# EAGLE design cytron-1 (EAGLE 9.6.2)
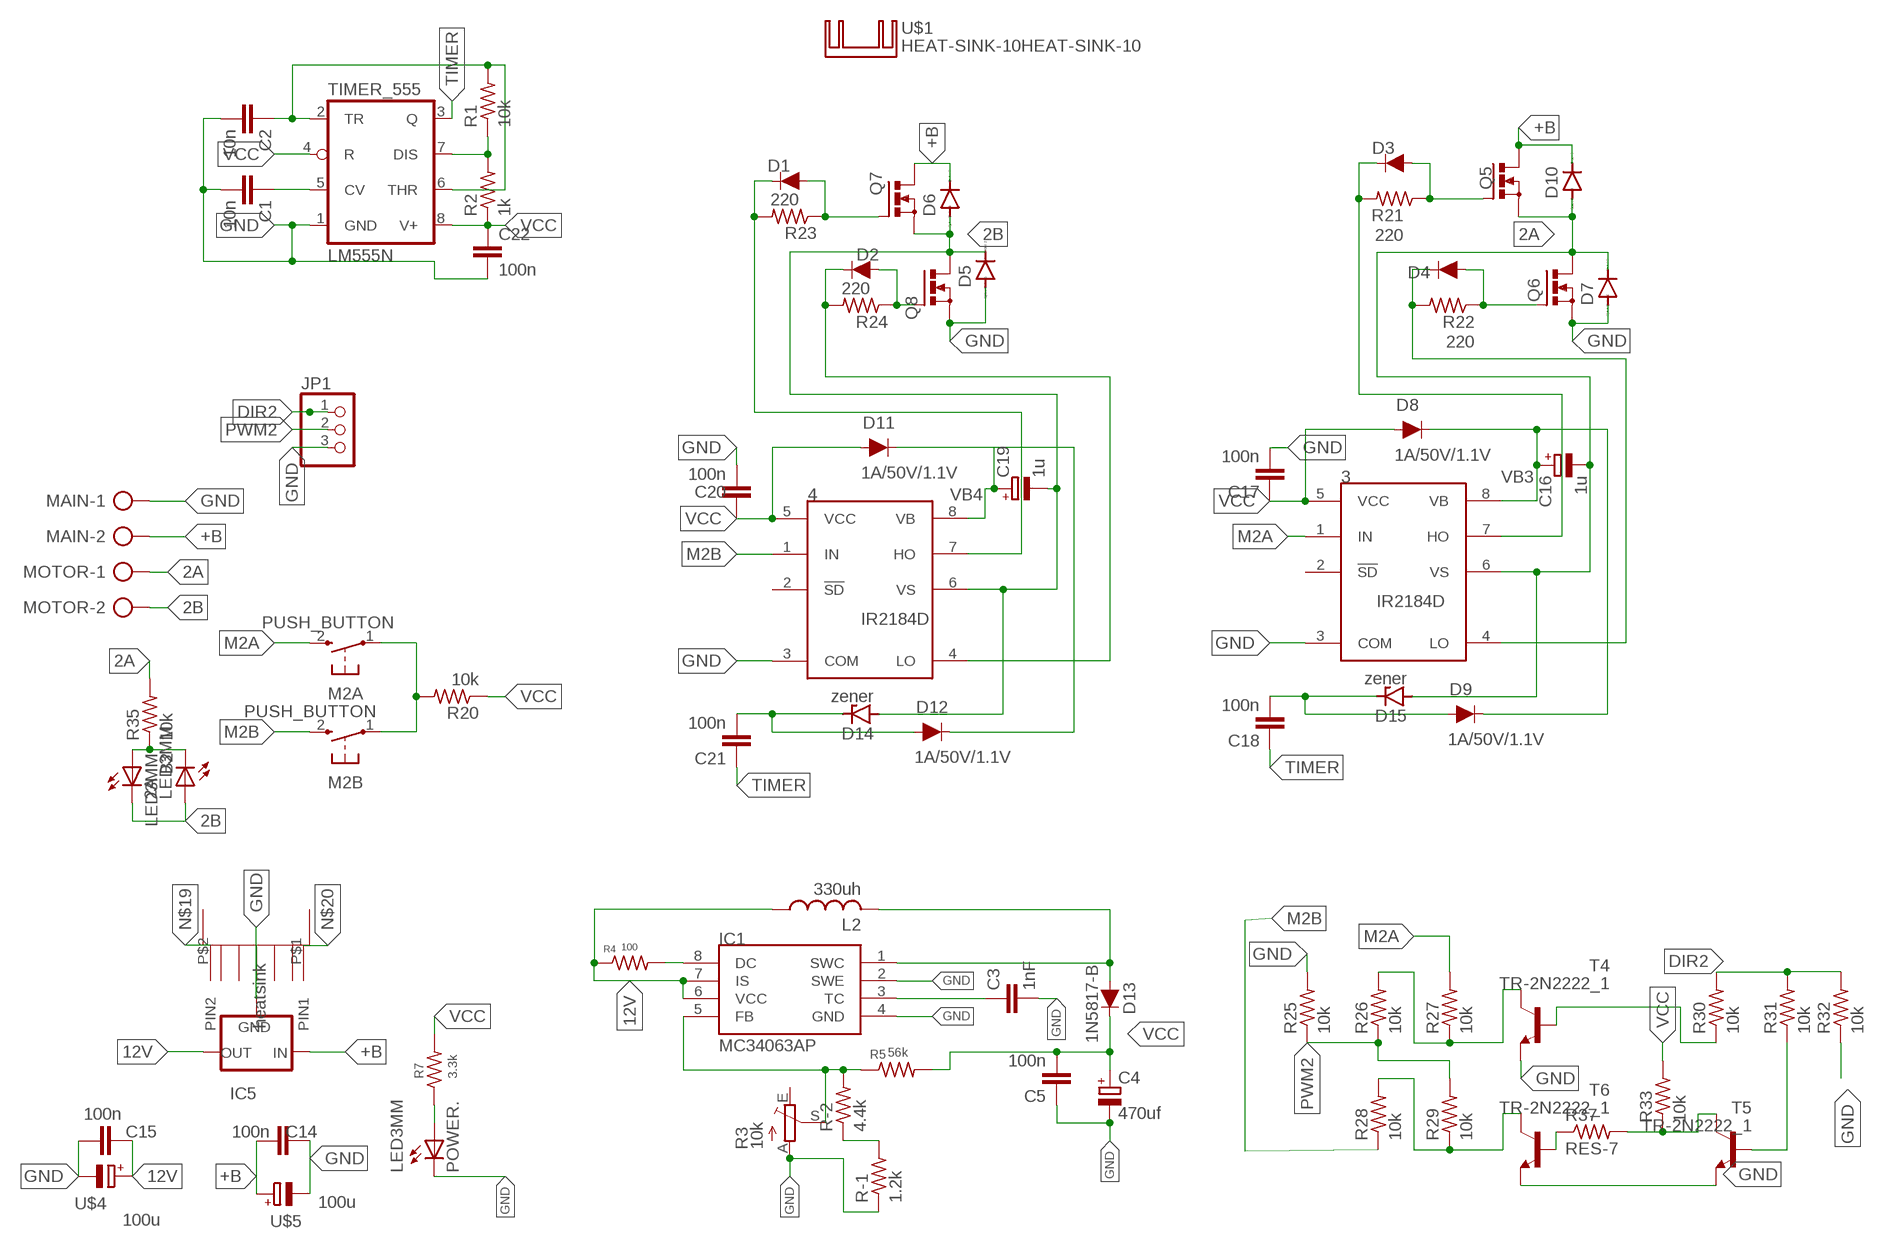
[diagram p0: schematic, sheet 1]

## Parts
2A  LED3MM  [LED3MM]
3  IR2184D  [DIL08]
4  IR2184D  [DIL08]
B2  LED3MM  [LED3MM]
C1  10n  CAPACITOR  [C025-025X050]
C2  10n  CAPACITOR  [C025-025X050]
C3  1nF  CAPACITOR  [C025-025X050]
C4  470uf  CAP_POL  [E3,5-8]
C5  100n  CAPACITOR  [C025-025X050]
C14  100n  CAPACITOR  [C025-025X050]
C15  100n  CAPACITOR  [C025-025X050]
C16  1u  CPOL-EUE5-5  [E5-5]
C17  100n  CAPACITOR  [C025-025X050]
C18  100n  CAPACITOR  [C025-025X050]
C19  1u  CPOL-EUE5-5  [E5-5]
C20  100n  CAPACITOR  [C025-025X050]
C21  100n  CAPACITOR  [C025-025X050]
C22  100n  CAPACITOR  [C025-025X050]
D1  1A/50V/1.1V  DIODE(1A)-PTH  [DIODE-1N4001]
D2  1A/50V/1.1V  DIODE(1A)-PTH  [DIODE-1N4001]
D3  1A/50V/1.1V  DIODE(1A)-PTH  [DIODE-1N4001]
D4  1A/50V/1.1V  DIODE(1A)-PTH  [DIODE-1N4001]
D5  BY396  [DO201-15]
D6  BY396  [DO201-15]
D7  BY396  [DO201-15]
D8  1A/50V/1.1V  DIODE(1A)-PTH  [DIODE-1N4001]
D9  1A/50V/1.1V  DIODE(1A)-PTH  [DIODE-1N4001]
D10  BY396  [DO201-15]
D11  1A/50V/1.1V  DIODE(1A)-PTH  [DIODE-1N4001]
D12  1A/50V/1.1V  DIODE(1A)-PTH  [DIODE-1N4001]
D13  1N5817-B  DIODE(1A)-PTH  [DIODE-1N4001]
D14  zener  BZD23  [SOD81]
D15  zener  BZD23  [SOD81]
IC1  MC34063AP  [DIL08]
IC5  78XXS  [78XXS]
JP1  PINHD-3_DATA  [1X03_DATA]
L2  330uh  INDUCTOR-2PIS2816  [PIS2816]
M2A  PUSH_BUTTON  [B3F-10XX]
M2B  PUSH_BUTTON  [B3F-10XX]
MAIN  ROSTA.POWER  [W239-302]
MOTOR  ROSTA.POWER  [W239-302]
POWER.  LED3MM  [LED3MM]
Q5  MOSFET_NTO220BV  [TO220BV]
Q6  MOSFET_NTO220BV  [TO220BV]
Q7  MOSFET_NTO220BV  [TO220BV]
Q8  MOSFET_NTO220BV  [TO220BV]
R1  10k  R-US_0204/7  [0204/7]
R2  1k  R-US_0204/7  [0204/7]
R3  10k  TRIM_EU-CA6V  [CA6V]
R4  100  RES-7  [0204/7]
R5  56k  RES-7  [0204/7]
R7  3.3k  RES-7  [0204/7]
R20  10k  R-US_0204/7  [0204/7]
R21  220  R-US_0204/7  [0204/7]
R22  220  R-US_0204/7  [0204/7]
R23  220  R-US_0204/7  [0204/7]
R24  220  R-US_0204/7  [0204/7]
R25  10k  R-US_0204/7  [0204/7]
R26  10k  R-US_0204/7  [0204/7]
R27  10k  R-US_0204/7  [0204/7]
R28  10k  R-US_0204/7  [0204/7]
R29  10k  R-US_0204/7  [0204/7]
R30  10k  R-US_0204/7  [0204/7]
R31  10k  R-US_0204/7  [0204/7]
R32  10k  R-US_0204/7  [0204/7]
R33  10k  R-US_0204/7  [0204/7]
R35  10k  R-US_0204/7  [0204/7]
R37  RES-7  [0204/7]
R-1  1.2k  RES-7  [0204/7]
R-2  4.4k  RES-7  [0204/7]
T4  TR-2N2222_1  [TO92-EBC]
T5  TR-2N2222_1  [TO92-EBC]
T6  TR-2N2222_1  [TO92-EBC]
TIMER_555  LM555N  [DIL08]
U$1  HEAT-SINK-10HEAT-SINK-10  [HS10]
U$3  HEAT-SINK  [HEAT_SINK]
U$4  100u  CAP_POL  [E3,5-8]
U$5  100u  CAP_POL  [E3,5-8]

## Nets
2A: 3.6(VS) C16.- D7.C D10.A D15.A MOTOR.1 Q5.S Q6.D R35.2
2B: 2A.K(C) 4.6(VS) B2.A C19.- D5.C D6.A D14.A MOTOR.2 Q7.S Q8.D
12V: C15.2 IC1.6(VCC) IC1.7(IS) IC5.OUT L2.1 R4.1 U$4.+
+B: C14.1 D6.C D10.C IC5.IN MAIN.2 Q5.D Q7.D U$5.+
DIR2: JP1.1 R30.2 R31.2 R32.2
GND: 3.3(COM) 4.3(COM) C1.2 C2.2 C3.2 C4.- C5.1 C14.2 C15.1 C17.2 C20.2 C22.2 D5.A D7.A IC1.2(SWE) IC1.4(GND) IC5.GND JP1.3 MAIN.1 POWER..K(C) Q6.S Q8.S R3.A R25.2 R32.1 R-1.1 T4.E T5.E T6.E TIMER_555.1(GND) U$4.- U$5.-
M2A: 3.1(IN) M2A.2(S) R27.2
M2B: 4.1(IN) M2B.2(S) R28.1
N$2: C1.1 TIMER_555.5(CV)
N$3: R1.1 R2.2 TIMER_555.7(DIS)
N$4: C2.1 R1.2 TIMER_555.2(TR) TIMER_555.6(THR)
N$5: D4.A Q6.G R22.1
N$6: 3.4(LO) D4.C R22.2
N$7: M2A.1(P) M2B.1(P) R20.2
N$8: R37.1 T6.B
N$9: C3.1 IC1.3(TC)
N$10: D13.A IC1.1(SWC) L2.2
N$11: 4.7(HO) D1.C R23.2
N$12: IC1.5(FB) R3.S R5.1 R-2.2
N$13: 4.4(LO) D2.C R24.2
N$15: IC1.8(DC) R4.2
N$16: POWER..A R7.1
N$19: U$3.P$2(PIN2)
N$20: U$3.P$1(PIN1)
N$21: R-1.2 R-2.1
N$25: D3.A Q5.G R21.1
N$30: 3.7(HO) D3.C R21.2
N$31: C18.2 D9.A D15.C
N$32: D2.A Q8.G R24.1
N$33: D1.A Q7.G R23.1
N$36: C21.2 D12.A D14.C
N$37: R28.2 R29.1 T6.C
N$38: R26.2 R27.1 T4.C
N$39: R30.1 T4.B
N$40: R33.1 R37.2 T5.C
N$41: R31.1 T5.B
N$46: 2A.A B2.K(C) R35.1
PWM2: JP1.2 R25.1 R26.1 R29.2
TIMER: C18.1 C21.1 TIMER_555.3(Q)
VB3: 3.8(VB) C16.+ D8.C D9.C
VB4: 4.8(VB) C19.+ D11.C D12.C
VCC: 3.5(VCC) 4.5(VCC) C4.+ C5.2 C17.1 C20.1 C22.1 D8.A D11.A D13.C R2.1 R5.2 R7.2 R20.1 R33.2 TIMER_555.4(R) TIMER_555.8(V+)
Unconnected: 3.2(!SD) 4.2(!SD) R3.E

## Library data of the parts
2A B2 = MIA_LIBRARY-2-2-2:LED3MM
3 4 = MIA_LIBRARY-2-2-2:IR2184
C1 C2 C5 C14 C15 C17 C18 C20-C22 = MIA_LIBRARY-2-2-2:CAPACITOR
C3 = MIA_LIBRARY-2-2-2:CAPACITOR; SPICEPREFIX: C
C4 = MIA_LIBRARY-2-2-2:CAP_POL; SPICEPREFIX: C
C16 C19 = rcl8:CPOL-EU: POLARIZED CAPACITOR, European symbol; SPICEPREFIX: C
D1-D4 D8 D9 D11 D12 = MIA_LIBRARY-2-2-2:DIODE(1A): Diode These are standard reverse protection diodes and small signal diodes. SparkFun Products: SparkFun SparkPunk Sound Kit <https://www.sparkfun.com/products/11177> SparkFun ESP8266 Thing <https://www.sparkfun.com/products/13231>; PROD_ID: DIO-09176
D5-D7 D10 = diode:BY396: DIODE Si,100 V, 3 A
D13 = MIA_LIBRARY-2-2-2:DIODE(1A): Diode These are standard reverse protection diodes and small signal diodes. SparkFun Products: SparkFun SparkPunk Sound Kit <https://www.sparkfun.com/products/11177> SparkFun ESP8266 Thing <https://www.sparkfun.com/products/13231>; PROD_ID: DIO-09176; SPICEPREFIX: D; VALUE: 1A/50V/1.1V
D14 D15 = diode:BZD23: Z DIODE
IC1 = MIA_LIBRARY-2-2-2:MC34063; SPICEPREFIX: X
IC5 = MIA_LIBRARY-2-2-2:78XXS: VOLTAGE REGULATOR
JP1 = MIA_LIBRARY-2-2-2:PINHD-3_DATA: PIN HEADER
L2 = MIA_LIBRARY-2-2-2:INDUCTOR-2: INDUCTOR, American symbol; SPICEPREFIX: L
M2A M2B = MIA_LIBRARY-2-2-2:PUSH_BUTTON: OMRON SWITCH
MAIN MOTOR = MIA_LIBRARY-2-2-2:ROSTA.POWER: WAGO SCREW CLAMP; OC_FARNELL: unknown; OC_NEWARK: unknown
POWER. = MIA_LIBRARY-2-2-2:LED3MM; SPICEPREFIX: B
Q5-Q8 = MIA_LIBRARY-2-2-2:MOSFET_N: Power MOSFET N-Channel
R1 R2 R20-R33 R35 = rcl8:R-US_: RESISTOR, American symbol; SPICEPREFIX: R
R3 = MIA_LIBRARY-2-2-2:TRIM_EU-: POTENTIOMETER; SPICEPREFIX: J
R4 R5 R7 = MIA_LIBRARY-2-2-2:RES-7; SPICEPREFIX: R
R37 = MIA_LIBRARY-2-2-2:RES-7; SPICEPREFIX: B
R-1 R-2 = MIA_LIBRARY-2-2-2:RES-7
T4-T6 = MIA_LIBRARY-2-2-2:TR-2N2222_1: NPN TRANSISTOR; SPICEPREFIX: J
TIMER_555 = linear:*555: TIMER
U$1 = MIA_LIBRARY-2-2-2:HEAT-SINK-10
U$3 = MIA_LIBRARY-2-2-2:HEAT-SINK
U$4 U$5 = MIA_LIBRARY-2-2-2:CAP_POL

## Board
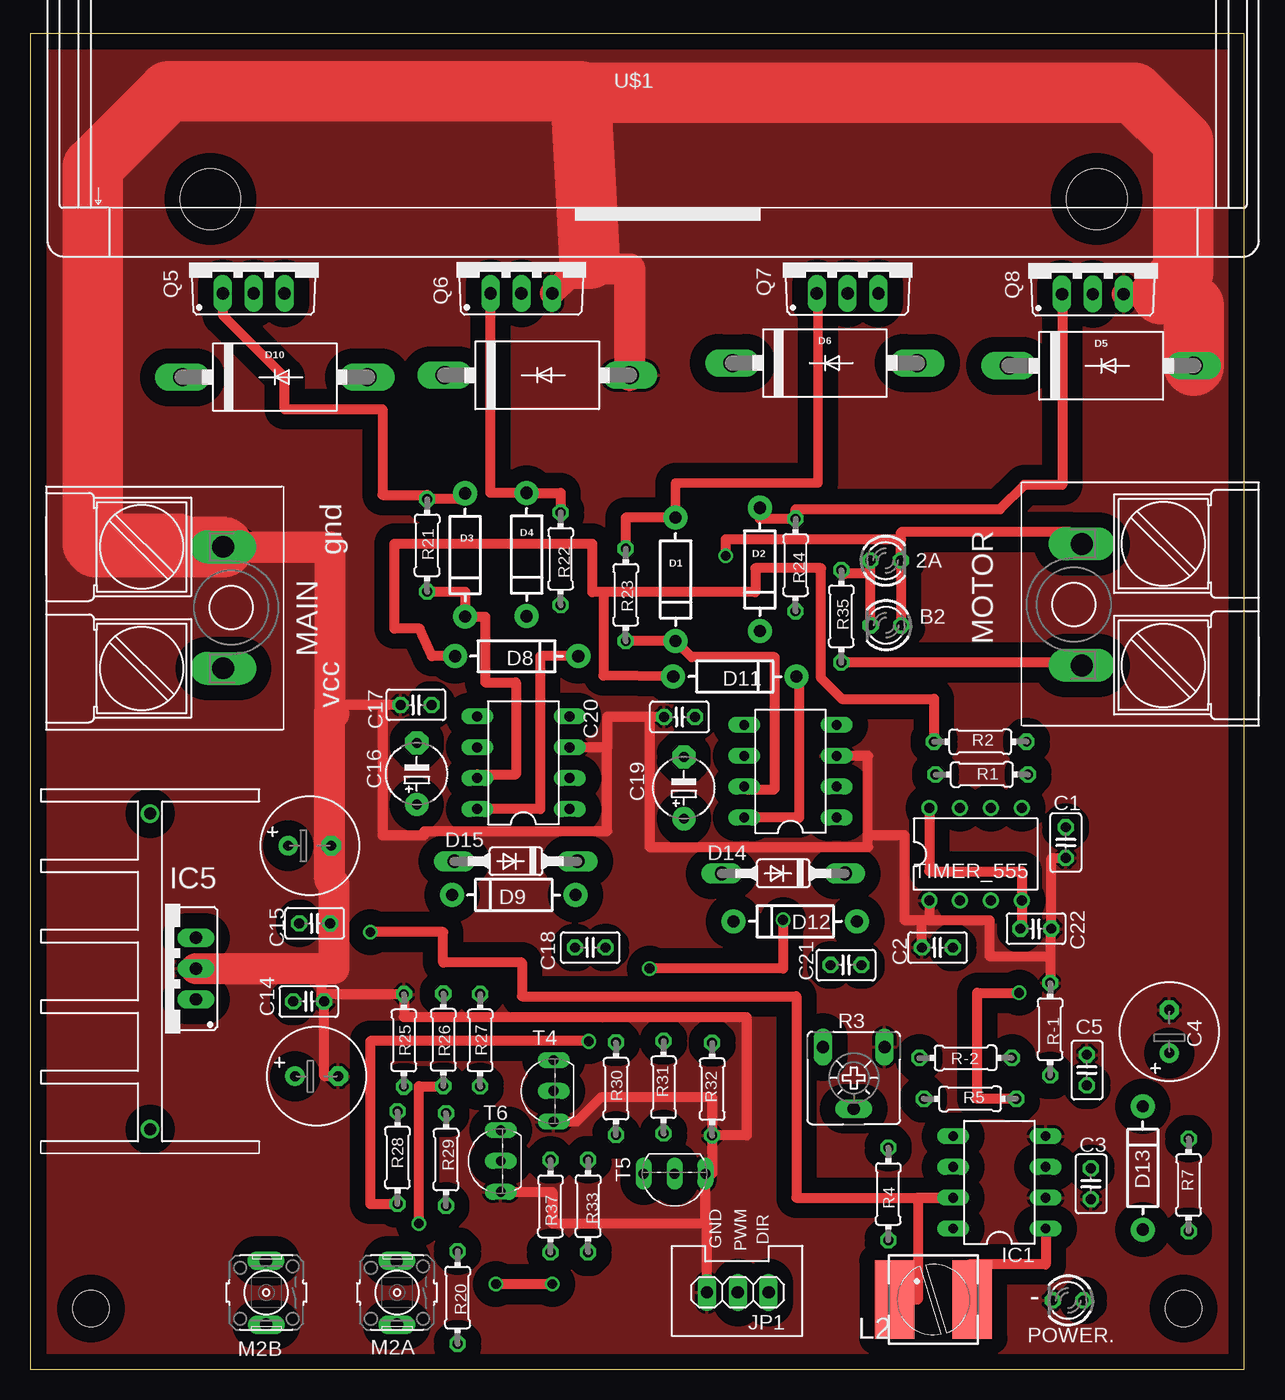
[diagram p1: board, top side]
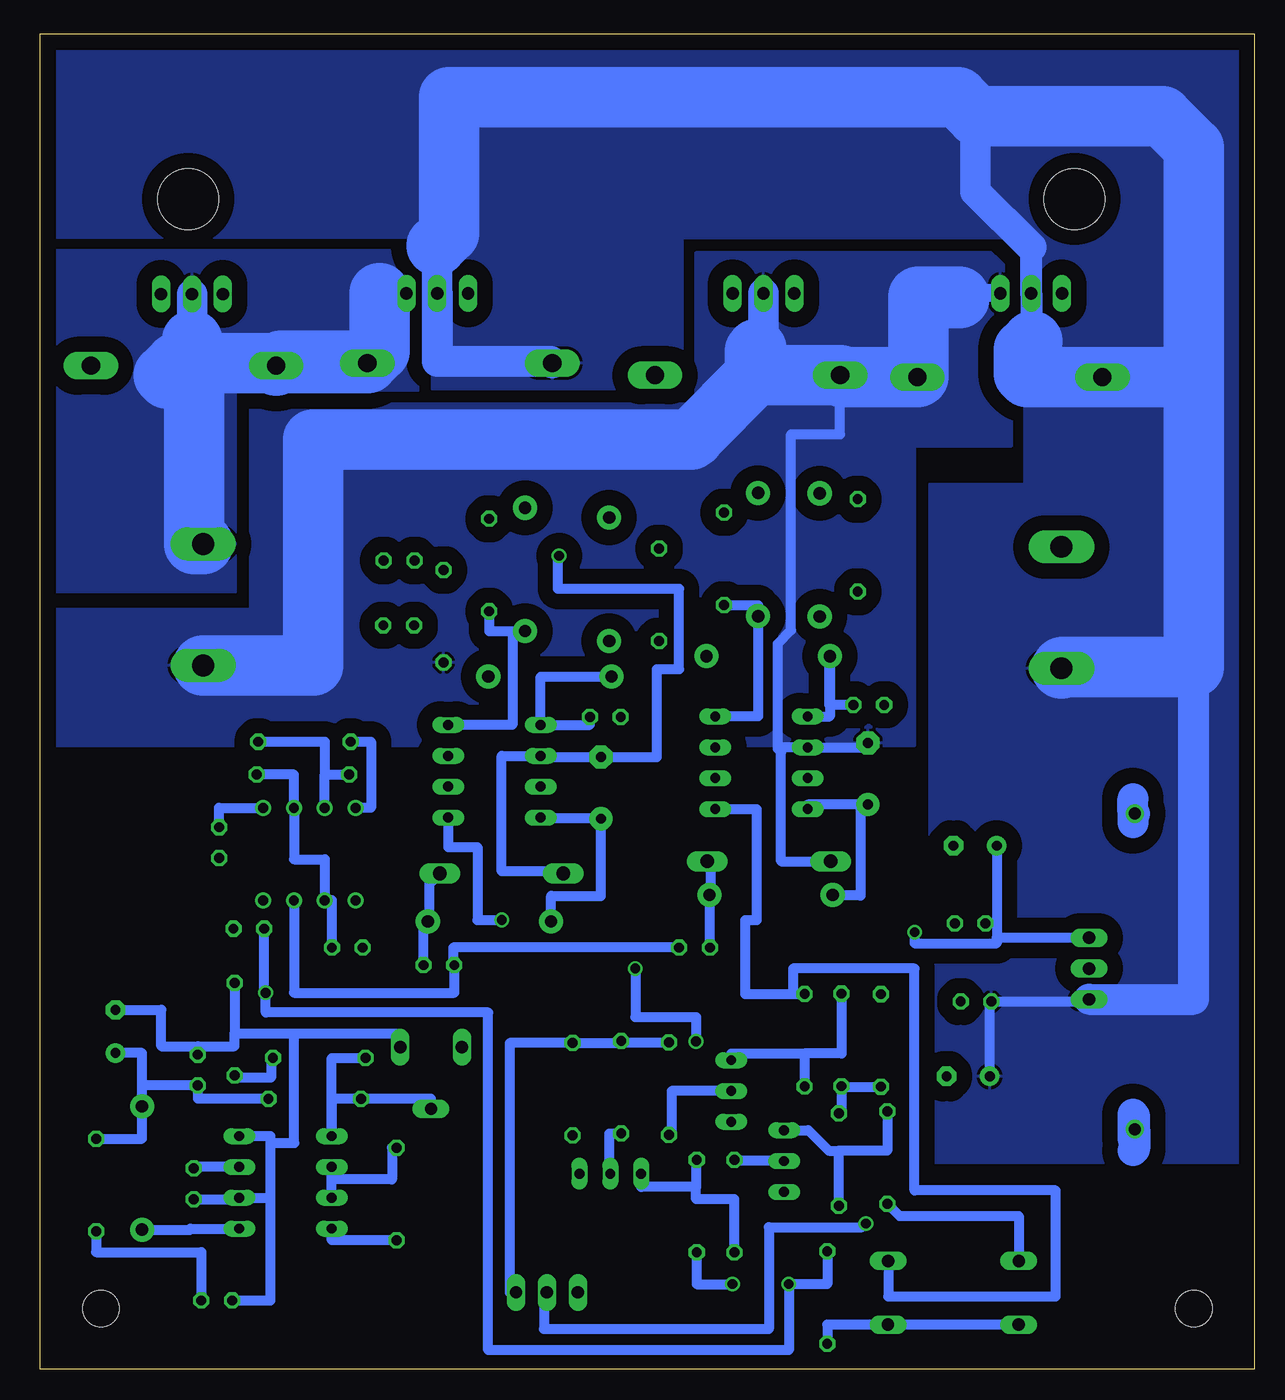
[diagram p2: board, bottom side, seen from below]

Size 100 x 110 mm. Coordinates in mm from the lower left corner, seen from the top.
Outline: 0,0 100,0 100,110 0,110 0,0
Copper layers (1*16): Top 0.035mm / dielectric 1.5mm / Bottom 0.035mm
Design rules "default *": minimum track width 6mil, minimum drill 0.35mm, track to track 0.8mm, track to pad 6mil, pad to pad 6mil, via to via 6mil, smd to smd 6mil, copper to edge 40mil, drill to drill 6mil, minimum pad ring 10mil, minimum via ring 8mil, stop-mask expansion 4mil, vias tented up to drill 0mil, thermal gap 10mil
Holes 3 mm at 95,5 5,5

### Footprints (pad centres in the part's own frame; a part is rotated, then mirrored left to right if it is on the bottom)
LED3MM = drill 0.813 octagon: A -1.27,0; K 1.27,0
DIL08 = drill 0.813 long: 1 -3.81,-3.81; 2 -1.27,-3.81; 3 1.27,-3.81; 4 3.81,-3.81; 5 3.81,3.81; 6 1.27,3.81; 7 -1.27,3.81; 8 -3.81,3.81
C025-025X050 = drill 0.813 octagon: 1 -1.27,0; 2 1.27,0
E3,5-8 = drill 0.813 pad 1.6: + -1.778,0 | drill 0.813 pad 1.6 octagon: - 1.778,0
E5-5 = drill 0.813 pad 1.905: + -2.54,0 | drill 0.813 pad 1.905 octagon: - 2.54,0
DIODE-1N4001 = drill 1 pad 1.981: A -5.08,0; C 5.08,0
DO201-15 = drill 1.499 long: A 7.62,0; C -7.62,0
SOD81 = drill 1.118 long: A 5.08,0; C -5.08,0
78XXS = drill 1.016 long: GND 0,-2.54; IN -2.54,-2.54; OUT 2.54,-2.54
1X03_DATA = drill 1.016 long: 1 -2.54,0; 2 0,0; 3 2.54,0
PIS2816 = smd 6.452 x 3.251: 1 0,3.2; 2 0,-3.2
B3F-10XX = drill 1.016 long: 1 0.013,2.636; 2 0.029,-2.605
W239-302 = drill 1.8 long: 1 -5,5; 2 5,5
TO220BV = drill 1.016 long: D 0,-2.54; G -2.54,-2.54; S 2.54,-2.54
0204/7 = drill 0.813 octagon: 1 -3.81,0; 2 3.81,0
CA6V = drill 1.016 long: A -2.54,-2.54; E 2.54,-2.54; S 0,2.54
TO92-EBC = drill 0.813 long: B 0,-1.27; C 2.54,-1.27; E -2.54,-1.27
DIL08' = drill 0.813 pad 1.27: 1 -3.81,-3.81; 2 -1.27,-3.81; 3 1.27,-3.81; 4 3.81,-3.81; 5 3.81,3.81; 6 1.27,3.81; 7 -1.27,3.81; 8 -3.81,3.81
HS10 = hole 5: -36.5,9; 36.5,9
HEAT_SINK = drill 1: P$1 0,13; P$2 0,-13

### Placement (x,y rotation side)
2A  70.45,66.6 0 top
3  40.61,49.95 90 top
4  62.61,49.25 90 top
B2  70.49,61.27 180 top
C1  85.28,43.37 270 top
C2  74.72,34.72 180 top
C3  87.37,15.27 270 top
C4  93.82,27.82 90 top
C5  87.04,24.64 270 top
C14  22.93,30.28 0 top
C15  23.42,36.72 180 top
C16  31.83,49.04 90 top
C17  31.77,54.72 180 top
C18  46.12,34.72 180 top
C19  53.83,47.88 90 top
C20  53.47,53.72 180 top
C21  67.18,33.28 0 top
C22  82.83,36.28 0 top
D1  53.15,65.05 270 top
D2  60.09,65.87 270 top
D3  35.81,67.06 270 top
D4  40.88,67.1 270 top
D5  88.21,82.65 0 top
D6  65.45,82.87 0 top
D7  41.75,81.87 0 top
D8  40.05,58.72 0 top
D9  39.82,39.06 180 top
D10  20.14,81.71 0 top
D11  58.03,57.05 0 top
D12  63.01,36.88 180 top
D13  91.63,16.57 90 top
D14  62.02,40.83 180 top
D15  39.99,41.83 180 top
IC1  79.82,15.38 90 top
IC5  11.09,33 90 top
JP1  58.28,6.33 180 top
L2  74.39,5.74 90 top
M2A  30.2,6.31 180 top
M2B  19.44,6.31 180 top
MAIN  10.9,62.73 270 top
MOTOR  91.6,62.97 90 top
POWER.  85.48,5.66 180 top
Q5  18.4,91.16 0 top
Q6  40.45,91.16 0 top
Q7  67.31,91.15 0 top
Q8  87.52,91.09 0 top
R1  78.37,48.98 0 top
R2  78.25,51.68 0 top
R3  67.83,23.98 180 top
R4  70.67,14.43 270 top
R5  77.41,22.27 0 top
R7  95.41,15.16 90 top
R20  35.19,5.9 270 top
R21  32.68,67.85 270 top
R22  43.68,66.75 270 top
R23  49.04,63.78 270 top
R24  63.03,66.23 270 top
R25  30.77,27.08 90 top
R26  34.02,27.12 90 top
R27  37.05,27.09 90 top
R28  30.24,17.42 90 top
R29  34.24,17.26 90 top
R30  48.24,23.1 90 top
R31  52.16,23.22 90 top
R32  56.16,23.06 90 top
R33  45.94,13.44 270 top
R35  66.8,62.01 270 top
R37  42.84,13.42 270 top
R-1  84,28 270 top
R-2  77.04,25.64 180 top
T4  41.83,22.91 90 top
T5  53.06,14.83 180 top
T6  37.48,17.14 90 top
TIMER_555  LM555N  [DIL08']  77.85,42.42 0 top
U$1  51.33,105.38 180 top
U$3  9.86,32.76 180 top
U$4  23.01,43.12 0 top
U$5  23.58,24.12 0 top

### Tracks (layer width: path | path; a pad name or v marks a point on that pad's centre or on a via)
2A
  Top 0.813: MOTOR.1 86.37,58.2 R35.2
  Bottom 0.813: C16.- 31.83,51.22 3.6 39,51.22 39,50.82 | D15.A 39,41.83 39,50.82 | D7.C 34.13,77 38.16,77 38.16,60.87 39.27,59.76 39.27,51.09 39,50.82
  Bottom 1.27: 27.7,88.29 27.7,88.22 27.18,88.22 27.18,88.62 26,88.62 24,88.62
  Bottom 1.5: Q5.S 26,88.62
  Bottom 2.5: Q6.D 40.45,84.44 40,84 40,83 41.13,81.87
  Bottom 5: MOTOR.1 77.52,57.97 77.52,76.58 46.42,76.58 46.26,76.75 | 46.18,76.75 46.26,76.75 | 27.18,88.22 24.29,88.22 24.29,88.35 27.7,88.35 27.7,88.29 27.7,81.77 D10.A 33.97,81.71 D7.C 41.13,81.87 | 41.13,81.87 46.26,76.75 | 41.13,81.87 41.13,83.87 41,84
  pour Bottom (isolate 1.27): 20.04,92 20.04,76 28,76 28,51.34 99,51.34 99,62.61 82.68,62.61 82.68,79.53 46,79.53 46,92
2B  (via drill 0.8)
  Top 0.813: MOTOR.2 85.62,68.95 71.72,68.95 71.72,68.34 | 71.72,68.34 57.28,68.34 v57.28,67 | B2.A 71.72,61.27 2A.K 71.72,68.34
  Bottom 0.813: D14.A 56.94,41 62,41 62,50.52 4.6 58.8,50.42 C19.- 49.23,50.42 49.23,57.66 47.4,57.66 47.4,64.26 57.37,64.26 57.37,66.91 v57.28,67 | Q7.S 72.07,88.61
  Bottom 2.5: Q8.D 87.52,84.77
  Bottom 5: 72.07,88.61 72.07,83.87 D6.A | MOTOR.2 87.33,67.97 87.33,81.59 | D6.A 88.84,82.87 89.84,81.87 89.56,81.59 87.33,81.59 | D5.C 80.19,83.05 73.25,83.05 D6.A | 87.52,84.77 87.52,81.78 87.33,81.59
  pour Bottom (isolate 1.27): 68.91,92.17 68.91,80.59 83.91,80.59 83.91,64 98.84,64 98.84,92.17
12V  (via drill 0.8)
  Top 0.813: L2.1 73.09,5.74 73.09,14.12 IC1.7 63.1,14.12 63.1,30.72 40.5,30.72 40.5,33.5 34,33.5 34,36 v28,36
  Bottom 0.813: IC1.7 IC1.6 76.01,15.63 71.04,15.63 71.04,18.23 R4.1 | IC5.OUT 21.23,35.54 | U$4.+ 21.23,36.72 | C15.2 21.23,36.72 | 21.23,36.72 21.23,35.54 | 21.23,35.54 21.23,35.07 28,35.07 v28,36
+B
  Bottom 0.813: U$5.+ 21.8,30.28 C14.1 13.63,30.28 IC5.IN
  Bottom 1.27: Q7.D 67.28,88.64 | 67.38,92 67.38,92.54
  Bottom 1.8: D10.C 13.81,83 18,83 18,85 18.4,85.4 Q5.D 18.4,92.4
  Bottom 2.5: 18.4,84.57 19,83.97 | 24.42,104.75 23,103.33 23,97 18.4,92.4 | Q7.D 67.31,91.94 67.38,92
  Bottom 2.54: 7.33,57.82 5,57.82 5,30.46 IC5.IN | D6.C 57.98,83.02 67.31,83.02 Q7.D
  Bottom 5: 5,81.71 D10.C 18.71,81.71 19,82 19,83.97 18.29,84.68 | 5,81.71 5,57.82 15.81,57.82 MAIN.2 | 5,81.71 5,100.6 7.59,103.19 22.86,103.19 24.42,104.75 66.36,104.75 66.36,93.56 67.38,92.54
  pour Bottom (isolate 1.27): 99,109.02 99,93.19 67.76,93.19 67.76,80.72 47.07,80.72 47.07,93.14 19,93.16 19,72.89 26.8,72.89 26.8,17 1,17 1,109.02
DIR2
  Bottom 0.813: R30.2 52.16,26.91 R31.2 52.16,26.87 R32.2 61.34,26.87 61.34,6.33 JP1.1
GND
  Top 0.813: 69,44 69,43 51,43 51,53.72 C20.2 47.51,53.72 47.51,51.22 | 69,44 69,50.52 4.3 | C17.2 29,54.72 | 29,54.72 29,44 32.47,44 32.47,44.33 47.51,44.33 47.51,51.22 | 47.51,51.22 3.3 | 69,44 72,44 72,37 73.45,37 | C1.2 84.1,42.1 C22.2 84,36.28 84,34 | TIMER_555.1 74.04,37 | 74.04,37 79,37 79,34 84,34 | C2.2 73.45,37 | 73.45,37 74.04,37 | T6.E 43,14.6 43,12 55.6,12 | 55.6,12 T5.E 56.16,16.1 R32.1 | JP1.3 55.74,12 55.6,12 | T4.E 45,20.37 47,22.37 56.16,22.37 R32.1 | R32.1 59,19.25 59,29 30.77,29 R25.2 24.2,30.89 C14.2 | U$5.- 24.2,24.12 C14.2 | 24,36.72 C15.1 24.79,36.82 U$4.- 25,42.91 25,35 | C14.2 24,30.28 24,32.85 | 29,54.72 25,54.72 25,54 | 46.07,91.47 43.22,88.62 Q6.S | 84,34 R-1.1
  Top 1.27: 92,88.55 93.15,88.55 | 94.89,88.55 94.17,88.55
  Top 2: Q8.S 92,88.55 | Q6.S 44.36,90 46,90 46,90.63
  Top 2.54: 24.67,54.33 24.67,67.73 MAIN.1 | 24.67,54.33 25,54 | IC5.GND 24,33 | 24,33 25,33 25,35 25,40 24.67,40.33 24.67,54.33 | 24,32.85 24,33 | 46,90.63 49.37,90.63 D7.A
  Top 5: 5.13,68 5.13,99.02 11.38,105.27 45.29,105.27 45.3,105.15 | 5.13,68 12.09,68 | 46.07,91.47 | 45.3,105.15 45.72,97.71 46.07,91.47 | MAIN.1 5.4,67.73 5.13,68 | D5.A 95.83,87.61 94.89,88.55 | 94.17,88.55 93.15,88.55 94.95,90.35 94.95,101.09 90.89,105.15 45.3,105.15
  Bottom 0.813: 81.04,14.12 IC1.2 83.63,13.99 C3.2 | IC1.4 81.04,19.2 81.04,18.64 | 81.04,14.12 81.04,18.64 | R3.A 70.37,27.64 79.09,27.64 | 79.09,27.64 84,27.64 | 81.04,18.64 79.09,18.64 79.09,27.64 | POWER..K 81.04,5.66 81.04,14.12 | C4.- 90.04,29.59 90.04,26.59 87.04,26.59 | 87.04,26.59 84.04,26.59 84.04,27.64 84,27.64 | C5.1 87.04,26.59 | R-1.1 84,27.64
  pour Top (isolate 1.27): 1,1 99,1 99,108.99 1,108.99
M2A
  Bottom 0.813: M2A.2 30.17,6 16.37,6 16.37,14.71 28,14.71 28,33 38,33 38,30.9 R27.2 41.97,30.9 41.97,36.97 41,36.97 41,46.14 3.1
M2B  (via drill 0.8)
  Top 0.813: v62,37 62,33 v51,33 | v46,27 46.03,27.03 28,27.03 28,13.61 R28.1
  Bottom 0.813: R28.1 29.24,12.61 19.41,12.61 M2B.2 | 4.1 66.42,43 64,43 64,37 v62,37 | v51,33 51,29 46,29 v46,27
N$2
  Bottom 0.813: C1.1 85.28,46.23 TIMER_555.5
N$3
  Bottom 0.813: TIMER_555.7 76.58,48.98 | 76.58,48.98 R1.1 | R2.2 76.58,51.68 76.58,48.98
N$4
  Bottom 0.813: C2.1 75.99,38.61 TIMER_555.2 76.58,42 79.12,42 TIMER_555.6 79.12,48.98 R1.2
N$5
  Top 0.813: R22.1 43.68,72.18 D4.A 37.91,72.18 Q6.G
N$6
  Bottom 0.813: R22.2 40.88,62.94 D4.C 40.88,53.76 3.4
N$7
  Bottom 0.813: M2B.1 M2A.1 35.19,3.67 R20.2
N$8
  Bottom 0.813: T6.B 42.84,17.14 R37.1
N$9
  Bottom 0.813: IC1.3 87.37,16.66 C3.1
N$10
  Top 0.813: IC1.1 83.63,8.63 77.34,8.63 77.59,8.03 L2.2
  Bottom 0.813: IC1.1 87.63,11.57 87.63,11.49 D13.A
N$11
  Top 0.813: R23.2 D1.C 54.47,58.65 61.31,58.65 61.31,47.79 61.23,47.71 59.07,47.71 4.7
N$12
  Bottom 0.813: R-2.2 76.01,25.64 IC1.5 76.01,22.27 R5.1 67.83,22.27 R3.S
N$13
  Bottom 0.813: R24.2 63.03,60.79 D2.C 60.99,60.79 61.12,60.66 61.12,53.06 4.4
N$15
  Bottom 0.813: R4.2 76.01,10.62 IC1.8
N$16
  Bottom 0.813: R7.1 95.41,9.63 86.75,9.63 POWER..A
N$19
  Bottom 2.54: 10,47 10,45.9 U$3.P$2 10,45.62 10,45
N$20
  Bottom 2.54: 10,19 10,21 9.86,20.86 U$3.P$1 9.86,18.14 10,18
N$21
  Bottom 0.813: R-2.1 81,25.64 81,24 84,24 R-1.2
N$25
  Top 0.813: Q5.G 15.86,86.82 20.95,81.73 20.95,79.06 29,79.06 29,72 32.68,72 R21.1 35.33,71.66 D3.A
N$30
  Top 0.813: 3.7 36.8,49 40,49 40,56.56 37.47,56.56 37.47,61.98 D3.C 35.81,64.04 R21.2
N$31
  Bottom 0.813: D15.C 44.8,41.56 44.8,39.01 44.85,39.06 D9.A 44.85,39.01 C18.2
N$32
  Top 0.813: D2.A 60.09,70.04 R24.1 63.03,70.83 79.87,70.83 81.87,72.83 85,72.83 85,88.53 Q8.G
N$33
  Top 0.8: D1.A 53.15,72.99 64.87,72.99 64.87,87.52
  Top 0.813: 64.87,87.52 64.78,87.61 Q7.G | D1.A 49.04,70.13 R23.1
N$36
  Bottom 0.813: D14.C 67.97,39.96 67.97,36.96 D12.A 68.45,36.52 C21.2
N$37
  Bottom 0.813: R28.2 30.24,18 34.24,18 | R29.1 34.24,18 | T6.C 36.75,19.68 35.07,18 34.24,18
N$38
  Bottom 0.813: R26.2 34.02,26 37.05,26 | 37.05,26 R27.1 | T4.C 43.1,26 37.05,26
N$39
  Bottom 0.813: T4.B 48,22.91 48,19.29 R30.1
N$40
  Bottom 0.813: R33.1 46,17.25 46,15 | 46,15 50.52,15 T5.C | R37.2 42.84,14 46,14 46,15
N$41
  Bottom 0.813: T5.B 53.06,17.1 53.16,17.2 53.16,19.41 R31.1
N$46
  Top 0.813: R35.1 67.1,65.52 69.18,65.52 69.18,66.52 | 69.18,66.52 2A.A | B2.K 69.22,66.52 69.18,66.52
PWM2  (via drill 0.8)
  Top 0.813: v32,12 32,23.31 R26.1
  Bottom 0.813: R25.1 33.98,23.27 R26.1 34.02,21.07 R29.2 | v32,12 32.32,11.68 40,11.68 40,3.32 58.55,3.32 58.51,3.37 58.51,6.1 JP1.2
TIMER
  Bottom 0.813: C18.1 66,34.72 66,33.28 C21.1 65.91,31 79.12,31 TIMER_555.3
VB3
  Top 0.813: D8.C 42,58.72 42,46.14 3.8
  Bottom 0.813: 3.8 36.8,46.5 C16.+ 32.44,46.5 32.44,38.99 32.69,39.06 D9.C
VB4
  Top 0.813: D11.C 63.31,57.06 63.31,45.44 4.8
  Bottom 0.813: 4.8 58.8,45.34 C19.+ 53.83,38.96 57.88,38.96 57.93,38.98 D12.C
VCC  (via drill 0.8)
  Top 0.813: TIMER_555.8 74.04,41 81.66,41 TIMER_555.4 81.66,36.28 C22.1 | R5.2 78,22.27 78,31 v81.44,31 | D8.A 33.09,58.72 32.08,61 30,61 30,68 46.28,68 46.28,64 47.21,64 | D11.A 47.21,57.12 47.21,64 | v43,7 v38.35,7 | R2.1 74.44,55.2 66.85,55.2 65.13,56.92 65.13,65.97 59.72,65.97 59.72,64 47.21,64
  Bottom 0.813: R5.2 87.04,22.27 C5.2 91.63,23.36 | R2.1 72.77,51.68 72.77,46.23 TIMER_555.8 | D11.A 58.8,57.05 4.5 54.74,53.06 C20.1 | 3.5 34.97,53.76 D8.A 35.04,58.66 35.04,54.72 C17.1 | C22.1 81.56,31 v81.44,31 81.44,29.38 63.12,29.38 63.12,1.56 38.35,1.56 v38.35,7 35.19,7 R20.1 | R33.2 45.94,7 v43,7 | R7.2 91.63,18.98 D13.C 91.63,23.36 | 91.63,23.36 91.63,26.04 C4.+

### Text on the board
tPlace: gnd | vcc | GND | PWM | DIR | -
bPlace: E:/logo.bmp